# EAGLE design attitude_driver (EAGLE 8.1.1)
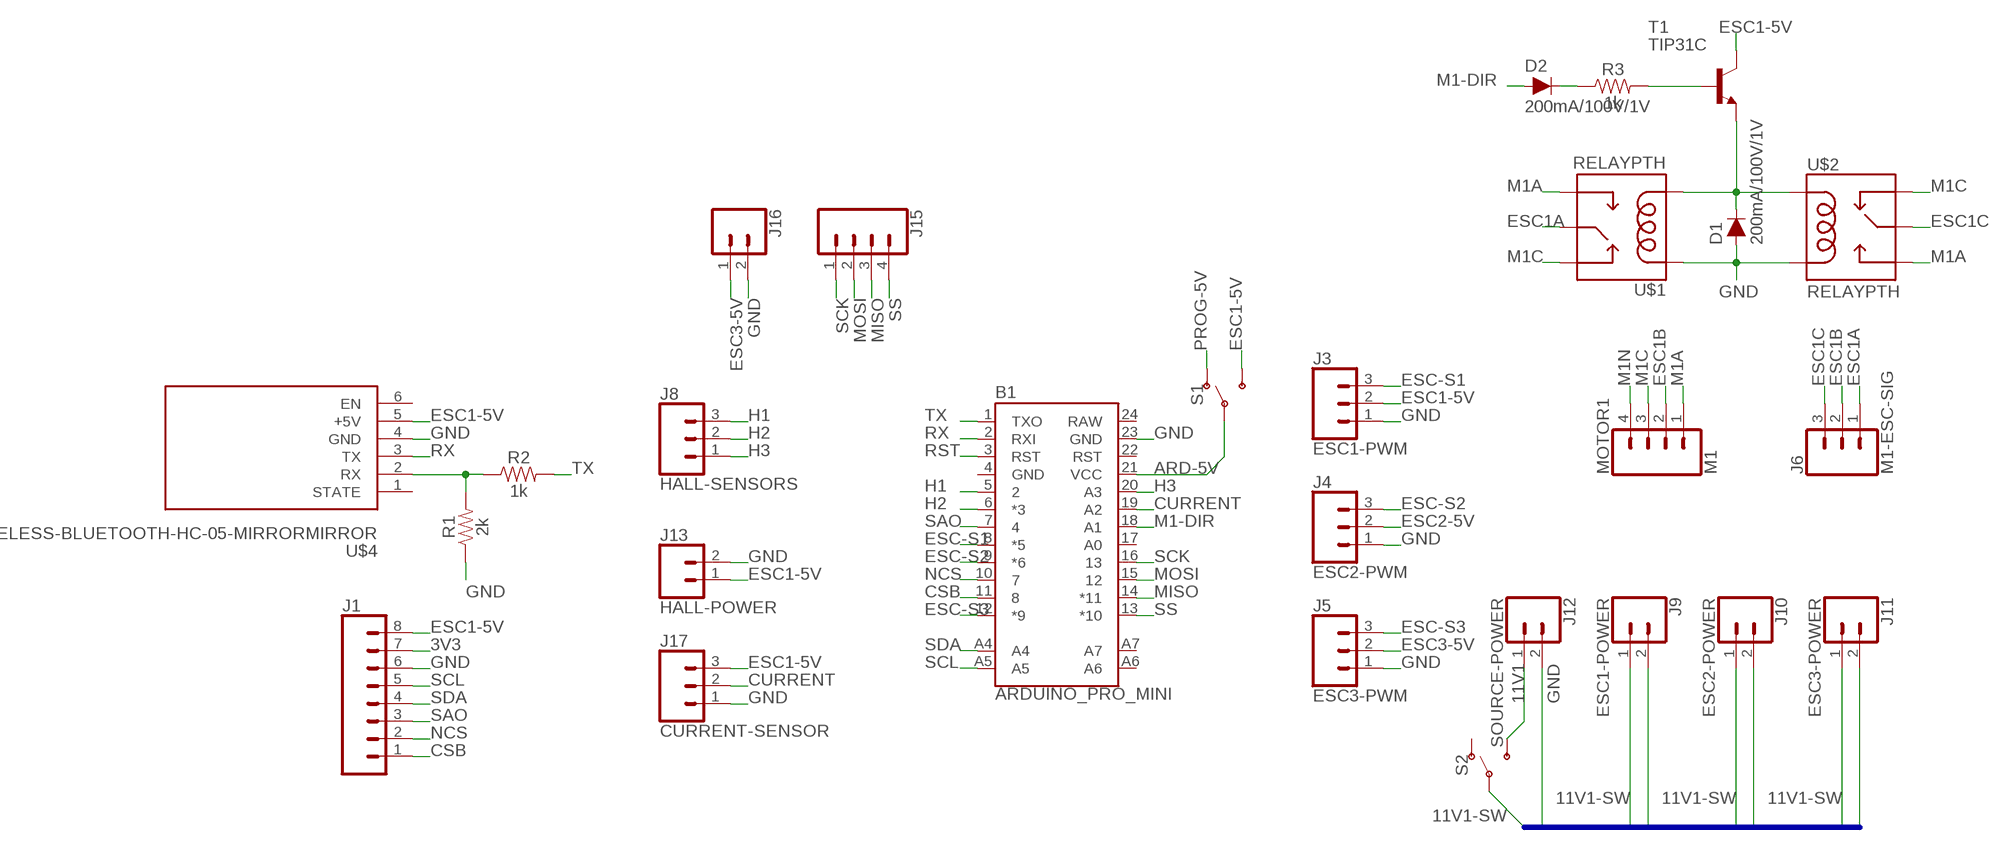
[diagram p0: schematic, sheet 1]

## Parts
B1  ARDUINO_PRO_MINI  [ARDUINO_PRO_MINI]
D1  200mA/100V/1V  DIODE-1N4148  [DIODE-1N4148]
D2  200mA/100V/1V  DIODE-1N4148  [DIODE-1N4148]
J1  GY-91LOCK_LONGPADS  [GY91_LONGPADS]
J3  ESC1-PWM  CONN_03LOCK_LONGPADS  [1X03_LOCK_LONGPADS]
J4  ESC2-PWM  CONN_03LOCK_LONGPADS  [1X03_LOCK_LONGPADS]
J5  ESC3-PWM  CONN_03LOCK_LONGPADS  [1X03_LOCK_LONGPADS]
J6  M1-ESC-SIG  CONN_03LOCK_LONGPADS  [1X03_LOCK_LONGPADS]
J8  HALL-SENSORS  CONN_03LOCK_LONGPADS  [1X03_LOCK_LONGPADS]
J9  ESC1-POWER  CONN_02LOCK_LONGPADS  [1X02_LOCK_LONGPADS]
J10  ESC2-POWER  CONN_02LOCK_LONGPADS  [1X02_LOCK_LONGPADS]
J11  ESC3-POWER  CONN_02LOCK_LONGPADS  [1X02_LOCK_LONGPADS]
J12  SOURCE-POWER  CONN_02LOCK_LONGPADS  [1X02_LOCK_LONGPADS]
J13  HALL-POWER  CONN_02LOCK_LONGPADS  [1X02_LOCK_LONGPADS]
J15  CONN_04LOCK_LONGPADS  [1X04_LOCK_LONGPADS]
J16  CONN_02LOCK_LONGPADS  [1X02_LOCK_LONGPADS]
J17  CURRENT-SENSOR  CONN_03LOCK_LONGPADS  [1X03_LOCK_LONGPADS]
MOTOR1  M1  CONN_04LOCK_LONGPADS  [1X04_LOCK_LONGPADS]
R1  2k  RESISTORAXIAL-0.3  [AXIAL-0.3]
R2  1k  1KOHM-HORIZ-1/4W-5%  [AXIAL-0.3]
R3  1k  1KOHM-HORIZ-1/4W-1%  [AXIAL-0.3]
S1  SWITCH-SPDT-PTH-11.6X4.0MM-LOCK  [SWITCH_SPDT_PTH_11.6X4.0MM_LOCK]
S2  SWITCH-SPDT-PTH-11.6X4.0MM-LOCK  [SWITCH_SPDT_PTH_11.6X4.0MM_LOCK]
T1  TIP31C  [TO220]
U$1  RELAYPTH  [SRD-05VDC-SL-C]
U$2  RELAYPTH  [SRD-05VDC-SL-C]
U$4  WIRELESS-BLUETOOTH-HC-05-MIRRORMIRROR  [WIRELESS-BLUETOOTH-HC-05-MIRROR]

## Nets
3V3: J1.7
11V1: J12.1 S2.3(S)
11V1-SW: J9.1 J10.1 J11.1 S2.2(P)
ARD-5V: B1.21(VCC) S1.2(P)
CSB: B1.11 J1.1
CURRENT: B1.19(A2) J17.2
ESC1-5V: J1.8 J3.2 J13.1 J17.3 S1.3(S) T1.2(C) U$4.5(+5V)
ESC1A: J6.1 U$1.SWCOMMON
ESC1B: J6.2 MOTOR1.2
ESC1C: J6.3 U$2.SWCOMMON
ESC2-5V: J4.2
ESC3-5V: J5.2 J16.1
ESC-S1: B1.8(*5) J3.3
ESC-S2: B1.9(*6) J4.3
ESC-S3: B1.12(*9) J5.3
GND: B1.23(GND) D1.A J1.6 J3.1 J4.1 J5.1 J9.2 J10.2 J11.2 J12.2 J13.2 J16.2 J17.1 R1.P$1 U$1.COIL1 U$2.COIL0 U$4.4(GND)
H1: B1.5 J8.3
H2: B1.6(*3) J8.2
H3: B1.20(A3) J8.1
M1-DIR: B1.18(A1) D2.A
M1A: MOTOR1.1 U$1.SWOPEN U$2.SWOPEN
M1C: MOTOR1.3 U$1.SWCLOSED(SWCLOSE) U$2.SWCLOSED(SWCLOSE)
M1N: MOTOR1.4
MISO: B1.14(*11) J15.3
MOSI: B1.15 J15.2
N$1: R1.P$2 R2.P$1 U$4.2(RX)
N$2: R3.P$2 T1.1(B)
N$3: D2.C R3.P$1
N$4: D1.C T1.3(E) U$1.COIL0 U$2.COIL1
NCS: B1.10 J1.2
PROG-5V: S1.1(O)
RST: B1.3(RST)
RX: B1.2(RXI) U$4.3(TX)
SAO: B1.7 J1.3
SCK: B1.16 J15.1
SCL: B1.A5 J1.5
SDA: B1.A4 J1.4
SS: B1.13(*10) J15.4
TX: B1.1(TXO) R2.P$2
Unconnected: B1.17(A0) B1.22(RST) B1.A6 B1.A7 S2.1(O) U$4.1(STATE) U$4.6(EN)

## Buses
GND,11V1-SW

## Power pins joined to a net without a drawn wire
GND: B1.4(GND)
RAW: B1.24(RAW)

## Library data of the parts
B1 = SparkFun-Boards:ARDUINO_PRO_MINI: SparkFun Pro Mini Pro Mini compatible footprint. Dimensions: 0.7 x 1.3" PCB Thickness: 0.8mm SparkFun Products: 3.3V/8MHz <https://www.sparkfun.com/products/11114> 5V/16MHz <https://www.sparkfun.com/products/11113>
D1 D2 = SparkFun-DiscreteSemi:DIODE: Diode These are standard reverse protection diodes and small signal diodes. SparkFun Products: SparkFun SparkPunk Sound Kit <https://www.sparkfun.com/products/11177> SparkFun ESP8266 Thing <https://www.sparkfun.com/products/13231>; PROD_ID: DIO-08378
J1 = gy-91:GY-91: Multi connection point. Often used as Generic Header-pin footprint for 0.1 inch spaced/style header connections On any of the 0.1 inch spaced packages, you can populate with these: Break Away Headers - Straight <https://www.sparkfun.com/products/116> (PRT-00116) Break Away Male Headers - Right Angle <https://www.sparkfun.com/products/553> (PRT-00553) Female Headers <https://www.sparkfun.com/products/115> (PRT-00115) Break Away Headers - Machine Pin <https://www.sparkfun.com/products/117> (PRT-00117) Break Away Female Headers - Swiss Machine Pin <https://www.sparkfun.com/products/743> (PRT-00743) Arduino Stackable Header - 8 Pin <https://www.sparkfun.com/products/9279> (PRT-09279) For SCREWTERMINALS and SPRING TERMINALS visit here: Screw Terimnals on SparkFun.com <https://www.sparkfun.com/search/results?term=Screw+Terminals> (5mm/3.5mm/2.54mm spacing) This device is also useful as a general connection point to wire up your design to another part of your project. Our various solder wires solder well into these plated through hole pads. Hook-Up Wire - Assortment (Stranded, 22 AWG) <https://www.sparkfun.com/products/11375> (PRT-11375) Hook-Up Wire - Assortment (Solid Core, 22 AWG) <https://www.sparkfun.com/products/11367> (PRT-11367) View the entire wire category on our website here <https://www.sparkfun.com/categories/141> Special notes: Molex polarized connector foot print use with SKU : PRT-08231 with associated crimp pins and housings. 1MM SMD Version SKU: PRT-10208 NOTES ON THE VARIANTS LOCK and LOCK_LONGPADS... This footprint was designed to help hold the alignment of a through-hole component (i.e. 6-pin header) while soldering it into place. You may notice that each hole has been shifted either up or down by 0.005 of an inch from it's more standard position (which is a perfectly straight line). This slight alteration caused the pins (the squares in the middle) to touch the edges of the holes. Because they are alternating, it causes a "brace" to hold the component in place. 0.005 has proven to be the perfect amount of "off-center" position when using our standard breakaway headers. Although looks a little odd when you look at the bare footprint, once you have a header in there, the alteration is very hard to notice. Also,if you push a header all the way into place, it is covered up entirely on the bottom side.
J3-J6 J8 J17 = SparkFun-Connectors:CONN_03: Multi connection point. Often used as Generic Header-pin footprint for 0.1 inch spaced/style header connections On any of the 0.1 inch spaced packages, you can populate with these: Break Away Headers - Straight <https://www.sparkfun.com/products/116> (PRT-00116) Break Away Male Headers - Right Angle <https://www.sparkfun.com/products/553> (PRT-00553) Female Headers <https://www.sparkfun.com/products/115> (PRT-00115) Break Away Headers - Machine Pin <https://www.sparkfun.com/products/117> (PRT-00117) Break Away Female Headers - Swiss Machine Pin <https://www.sparkfun.com/products/743> (PRT-00743) Stackable Header - 3 Pin (Female, 0.1") <https://www.sparkfun.com/products/13875> (PRT-13875) For SCREWTERMINALS and SPRING TERMINALS visit here: Screw Terimnals on SparkFun.com <https://www.sparkfun.com/search/results?term=Screw+Terminals> (5mm/3.5mm/2.54mm spacing) This device is also useful as a general connection point to wire up your design to another part of your project. Our various solder wires solder well into these plated through hole pads. Hook-Up Wire - Assortment (Stranded, 22 AWG) <https://www.sparkfun.com/products/11375> (PRT-11375) Hook-Up Wire - Assortment (Solid Core, 22 AWG) <https://www.sparkfun.com/products/11367> (PRT-11367) View the entire wire category on our website here <https://www.sparkfun.com/categories/141> Special notes: Molex polarized connector foot print use with SKU : PRT-08232 with associated crimp pins and housings.
J9-J13 J16 = SparkFun-Connectors:CONN_02: Multi connection point. Often used as Generic Header-pin footprint for 0.1 inch spaced/style header connections On any of the 0.1 inch spaced packages, you can populate with these: Break Away Headers - Straight <https://www.sparkfun.com/products/116> (PRT-00116) Break Away Male Headers - Right Angle <https://www.sparkfun.com/products/553> (PRT-00553) Female Headers <https://www.sparkfun.com/products/115> (PRT-00115) Break Away Headers - Machine Pin <https://www.sparkfun.com/products/117> (PRT-00117) Break Away Female Headers - Swiss Machine Pin <https://www.sparkfun.com/products/743> (PRT-00743) For SCREWTERMINALS and SPRING TERMINALS visit here: Screw Terimnals on SparkFun.com <https://www.sparkfun.com/search/results?term=Screw+Terminals> (5mm/3.5mm/2.54mm spacing) This device is also useful as a general connection point to wire up your design to another part of your project. Our various solder wires solder well into these plated through hole pads. Hook-Up Wire - Assortment (Stranded, 22 AWG) <https://www.sparkfun.com/products/11375> (PRT-11375) Hook-Up Wire - Assortment (Solid Core, 22 AWG) <https://www.sparkfun.com/products/11367> (PRT-11367) View the entire wire category on our website here <https://www.sparkfun.com/categories/141> Special notes: Molex polarized connector foot print use with: PRT-08233 with associated crimp pins and housings. 2.54_SCREWTERM for use with PRT-10571. 3.5mm Screw Terminal footprints for PRT-08084 5mm Screw Terminal footprints for use with PRT-08432
J15 MOTOR1 = SparkFun-Connectors:CONN_04: Multi connection point. Often used as Generic Header-pin footprint for 0.1 inch spaced/style header connections On any of the 0.1 inch spaced packages, you can populate with these: Break Away Headers - Straight <https://www.sparkfun.com/products/116> (PRT-00116) Break Away Male Headers - Right Angle <https://www.sparkfun.com/products/553> (PRT-00553) Female Headers <https://www.sparkfun.com/products/115> (PRT-00115) Break Away Headers - Machine Pin <https://www.sparkfun.com/products/117> (PRT-00117) Break Away Female Headers - Swiss Machine Pin <https://www.sparkfun.com/products/743> (PRT-00743) For SCREWTERMINALS and SPRING TERMINALS visit here: Screw Terimnals on SparkFun.com <https://www.sparkfun.com/search/results?term=Screw+Terminals> (5mm/3.5mm/2.54mm spacing) This device is also useful as a general connection point to wire up your design to another part of your project. Our various solder wires solder well into these plated through hole pads. Hook-Up Wire - Assortment (Stranded, 22 AWG) <https://www.sparkfun.com/products/11375> (PRT-11375) Hook-Up Wire - Assortment (Solid Core, 22 AWG) <https://www.sparkfun.com/products/11367> (PRT-11367) View the entire wire category on our website here <https://www.sparkfun.com/categories/141> Special notes: Molex polarized connector foot print use with SKU : PRT-08231 with associated crimp pins and housings. 1MM SMD Version SKU: PRT-10208; PROD_ID: CONN-09696
R1 = resistors-longpads:RESISTOR: Generic Resistor Package
R2 = resistors-longpads:1KOHM: 1kΩ resistor A resistor is a passive two-terminal electrical component that implements electrical resistance as a circuit element. Resistors act to reduce current flow, and, at the same time, act to lower voltage levels within circuits. - Wikipedia; PROD_ID: RES-08380
R3 = SparkFun-Resistors:1KOHM: 1kΩ resistor A resistor is a passive two-terminal electrical component that implements electrical resistance as a circuit element. Resistors act to reduce current flow, and, at the same time, act to lower voltage levels within circuits. - Wikipedia; PROD_ID: RES-12182
S1 S2 = switch-longpads:SWITCH-SPDT: Single Pole, Double Throw (SPDT) Switch Single-pole, double-throw (SPDT) switch. Variant Overview SMD-AYZ0202 Surface Mount DPDT Switch <https://www.sparkfun.com/products/597> (COM-00597) Used on e.g. LilyPad Arduino USB - ATmega32U4 Board <https://www.sparkfun.com/products/12049> PTH-11.6X4.0MM SPDT Mini Power Switch <https://www.sparkfun.com/products/102> (COM-00102) Used on e.g. SparkFun Simon Says - Through-Hole Soldering Kit <https://www.sparkfun.com/products/10547> (KIT-10547) PTH-11.6X4.0MM-KIT KIT version of SPDT Mini Power Switch - Simplifies soldering by removing tStop of switch pins - only one side can be soldered. PTH-11.6X4.0MM-LOCK LOCK version of SPDT Mini Power Switch - Offset pins hold switch in place for easier soldering. SMD-RIGHT-ANGLE Surface Mount Right Angle Switch <https://www.sparkfun.com/products/10860> (COM-10860) Used on e.g. SparkFun ESP8266 Thing <https://www.sparkfun.com/products/13231>; PROD_ID: SWCH-08261; SF_SKU: COM-00102
T1 = transistor-neu-to92:TIP31C: NPN TRANSISTOR
U$1 U$2 = SRD-05VDC-SL-C:RELAY: SPDT relay (COM-00101)
U$4 = diy-modules:WIRELESS-BLUETOOTH-HC-05-MIRROR: Bluetooth Transceiver Module based on HC-05 board Tutorial is available here: https://arduino-info.wikispaces.com/BlueTooth-HC05-HC06-Modules-How-To Click here to find device on ebay.com <http://www.ebay.com/sch/hc-05+module+rs232>

## Net classes
0 default: width 1 mm, clearance 0.3 mm

## Board
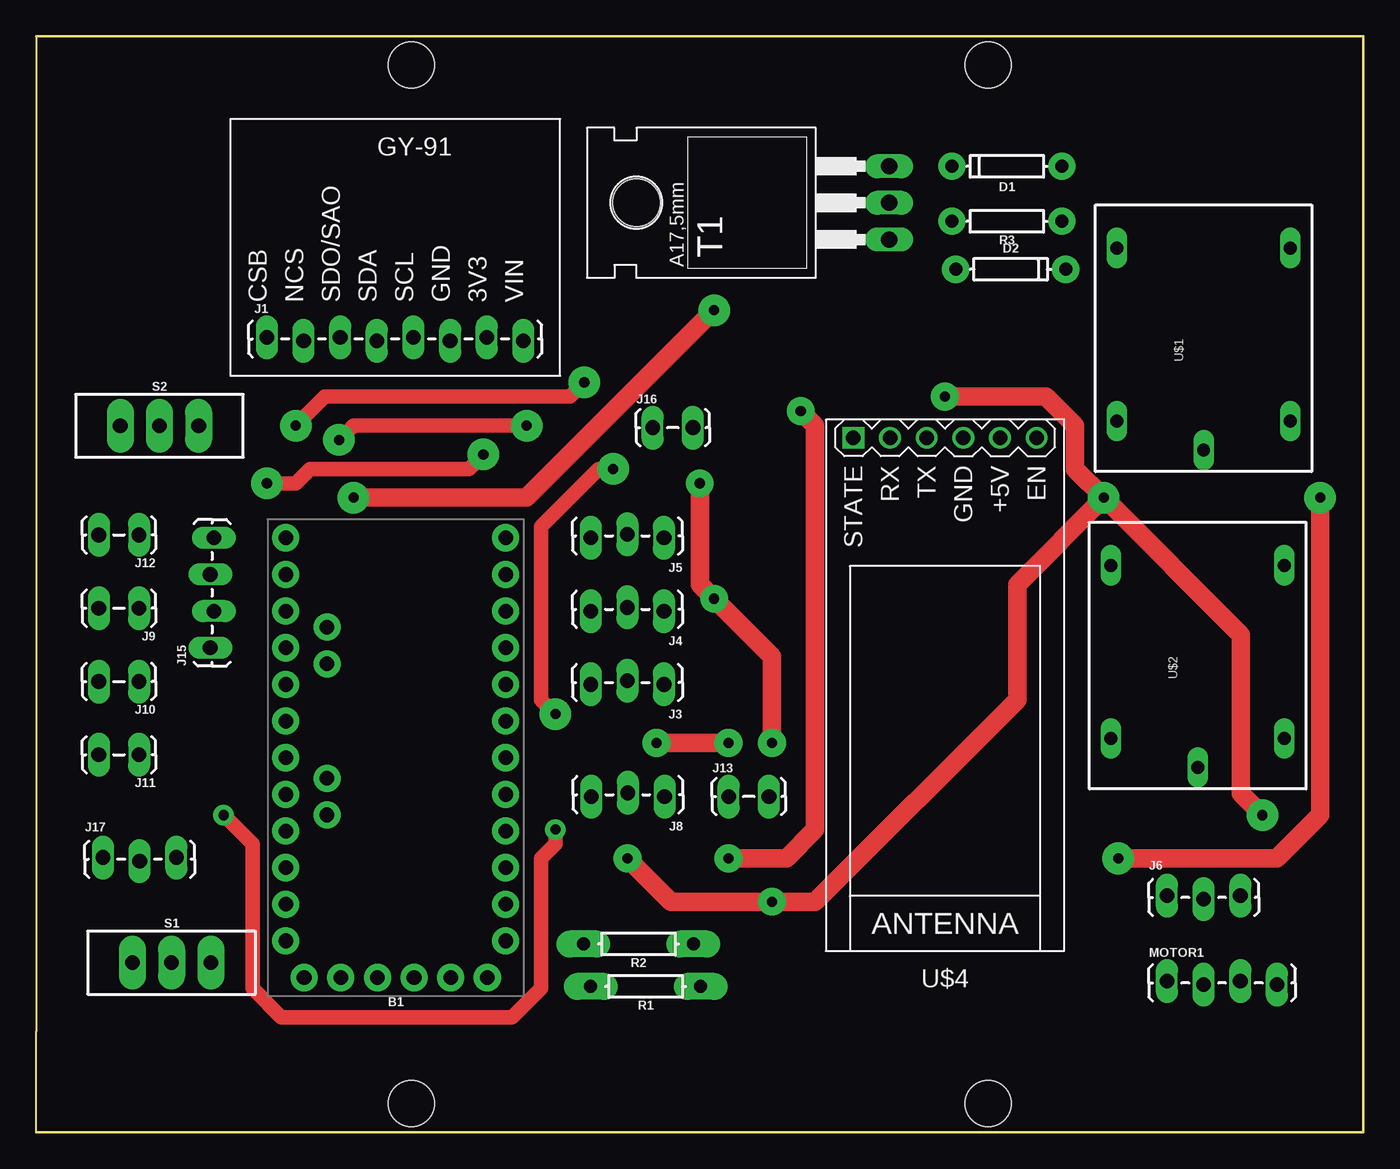
[diagram p1: board, top side]
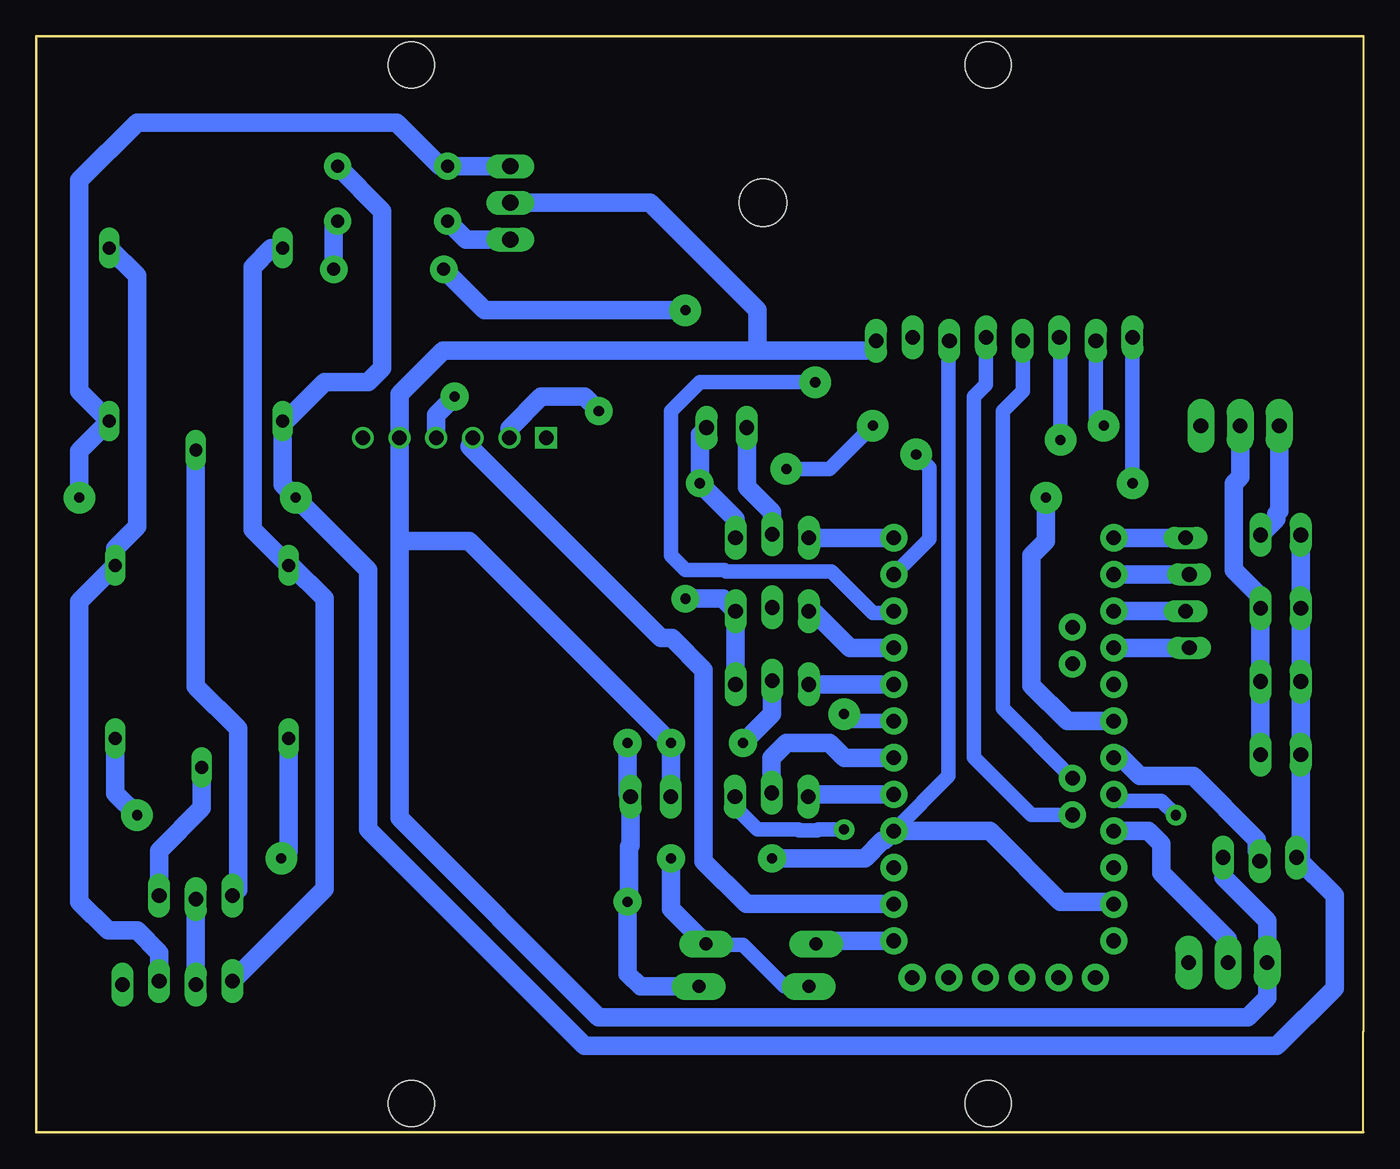
[diagram p2: board, bottom side, seen from below]

Size 92 x 76 mm. Coordinates in mm from the lower left corner, seen from the top.
Outline: 0,76 0,7 0,0 92,0 92,76 0,76
Copper layers (1*16): Top 0.035mm / dielectric 1.5mm / Bottom 0.035mm
Design rules "attitude_driver *": minimum track width 1mm, minimum drill 0.7mm, track to track 0.205mm, track to pad 0.205mm, pad to pad 0.205mm, via to via 0.205mm, smd to smd 6mil, copper to edge 1mm, drill to drill 6mil, minimum pad ring 10mil, minimum via ring 8mil, stop-mask expansion 4mil, vias tented up to drill 0mil, thermal gap 10mil
Holes 3.2 mm at 66,2 26,2 66,74 26,74

### Footprints (pad centres in the part's own frame; a part is rotated, then mirrored left to right if it is on the bottom)
ARDUINO_PRO_MINI = drill 1.016 pad 1.88: 1 -7.62,12.7; 2 -7.62,10.16; 3 -7.62,7.62; 4 -7.62,5.08; 5 -7.62,2.54; 6 -7.62,0; 7 -7.62,-2.54; 8 -7.62,-5.08; 9 -7.62,-7.62; 10 -7.62,-10.16; 11 -7.62,-12.7; 12 -7.62,-15.24; 13 7.62,-15.24; 14 7.62,-12.7; 15 7.62,-10.16; 16 7.62,-7.62; 17 7.62,-5.08; 18 7.62,-2.54; 19 7.62,0; 20 7.62,2.54; 21 7.62,5.08; 22 7.62,7.62; 23 7.62,10.16; 24 7.62,12.7; A4 4.763,1.429; A5 4.763,3.969; A6 4.763,-9.049; A7 4.763,-6.509; BLK -6.35,15.24; GND -3.81,15.24; GRN 6.35,15.24; RXI 1.27,15.24; TXO 3.81,15.24; VCC -1.27,15.24
DIODE-1N4148 = drill 0.9 pad 1.88: A -3.81,0; C 3.81,0
GY91_LONGPADS = drill 1.016 long: 1 0,0.127; 2 2.54,-0.127; 3 5.08,0.127; 4 7.62,-0.127; 5 10.16,0.127; 6 12.7,-0.127; 7 15.24,0.127; 8 17.78,-0.127
1X03_LOCK_LONGPADS = drill 1.016 long: 1 0,0; 2 2.54,-0.254; 3 5.08,0
1X02_LOCK_LONGPADS = drill 1.016 long: 1 -0.127,0; 2 2.667,0
1X04_LOCK_LONGPADS = drill 1.016 long: 1 0,0; 2 2.54,-0.254; 3 5.08,0; 4 7.62,-0.254
AXIAL-0.3 = drill 0.9 pad 1.88 long: P$1 -3.81,0; P$2 3.81,0
AXIAL-0.3' = drill 0.9 pad 1.88: P$1 -3.81,0; P$2 3.81,0
SWITCH_SPDT_PTH_11.6X4.0MM_LOCK = drill 1.016 pad 1.88 long: 1 0,2.718; 2 0,0; 3 0,-2.718
TO220 = drill 1.118 long: 1 -2.54,-6.35; 2 0,-6.35; 3 2.54,-6.35 | hole 3.302: 0,11.176
SRD-05VDC-SL-C = drill 0.9 long: COIL0 -5.39,-6.12; COIL1 -5.39,5.88; SWCLOSED 6.61,-6.12; SWCOMMON -7.39,-0.12; SWOPEN 6.61,5.88
WIRELESS-BLUETOOTH-HC-05-MIRROR = drill 1 square: 1 6.35,-17.145 | drill 1: 2 3.81,-17.145; 3 1.27,-17.145; 4 -1.27,-17.145; 5 -3.81,-17.145; 6 -6.35,-17.145

### Placement (x,y rotation side)
B1  24.93,25.98 180 top
D1  67.29,66.98 180 top
D2  67.55,59.83 0 top
J1  16,55 0 top
J3  43.52,31.06 180 top
J4  43.52,36.14 180 top
J5  43.52,41.22 180 top
J6  78.39,16.42 0 top
J8  43.56,23.29 180 top
J9  7.01,36.34 180 top
J10  7.01,31.26 180 top
J11  7.01,26.18 180 top
J12  7.01,41.42 180 top
J13  48.13,23.29 0 top
J15  12.07,33.6 90 top
J16  42.86,48.86 0 top
J17  4.64,19.07 0 top
MOTOR1  78.39,10.5 0 top
R1  42.25,10.12 180 top
R2  41.75,13.07 180 top
R3  1k  [AXIAL-0.3']  67.29,63.17 180 top
S1  9.39,11.77 270 top
S2  8.55,48.98 270 top
T1  52.78,64.44 90 top
U$1  80.8,54.7 90 top
U$2  80.39,32.7 90 top
U$4  63,31 180 top

### Tracks (layer width: path | path; a pad name or v marks a point on that pad's centre or on a via)
11V1
  Bottom 1.27: J12.1 6.04,42.52 6.04,42.88 5.83,43.09 S2.3
11V1-SW
  Bottom 1.27: J11.1 J10.1 J9.1 7.14,37.14 9,39 9,45 8.55,45.45 S2.2
ARD-5V
  Bottom 1.27: S1.2 9.39,13.39 14,18 14,20 14.9,20.9 B1.21
CSB  (via drill 0.7 pad 2.18)
  Top 1.016: v16,45 18,45 19,46 30,46 v31,47
  Bottom 1.016: B1.11 30.08,41.15 30.08,46.08 v31,47 | v16,45 J1.1
CURRENT
  Bottom 1.27: J17.2 7.38,19.54 7.38,20.27 11.8,24.7 15.49,24.7 16.96,26.18 B1.19
ESC1-5V  (via drill 0.7 pad 1.93)
  Top 1.27: v43,27 v48,27
  Bottom 1.27: 42,54.2 33.92,54.2 J1.8 | T1.2 49.44,64.44 42,57 42,54.2 | J17.3 9.72,17.72 6.67,14.67 S1.3 6.67,9.33 8,8 53,8 66.81,21.81 66.81,41 | J3.2 40.98,29.02 v43,27 | J13.1 v48,27 62,41 66.81,41 | 66.81,45.81 U$4.5 | 66.81,41 U$4.5 | U$4.5 66.81,51.19 63.8,54.2 42,54.2
ESC1A
  Bottom 1.27: U$1.SWCOMMON 80.92,30.92 78,28 78,16.81 J6.1
ESC1B
  Bottom 1.27: MOTOR1.2 J6.2
ESC1C
  Bottom 1.27: J6.3 83.47,19.53 80.51,22.49 U$2.SWCOMMON
ESC3-5V
  Bottom 1.27: J5.2 41,41.47 41,43 42.73,44.73 J16.1
ESC-S1
  Bottom 1.27: J3.3 B1.8
ESC-S2
  Bottom 1.27: J4.3 38.14,36.14 35.6,33.6 B1.9
ESC-S3
  Bottom 1.27: J5.3 B1.12
GND  (via drill 0.7 pad 1.93, 0.7 pad 2.18)
  Top 1.27: v74,44 83.5,34.5 83.5,23.5 v85,22 | v46,45 46,38 v47,37 51,33 v51,27 | v41,19 44,16 v51,16 54,16 68,30 68,38 v74,44 | v63,51 70,51 72,49 72,46 v74,44
  Bottom 1.016: 32.45,21.01 28.76,24.7 28.76,54.2
  Bottom 1.27: 32.45,21.01 B1.4 | 28.76,54.2 J1.6 | J12.2 J9.2 J10.2 J11.2 4.34,19.07 J17.1 2,16.43 2,10 6,6 54,6 69,21 69,39 v74,44 74.92,44.92 U$1.COIL1 74.69,49.31 72,52 69,52 68,53 68,63.88 D1.A | B1.23 17.49,16 21,16 25.9,20.9 B1.4 | v85,22 86.51,23.51 U$2.COIL0 | J3.1 J4.1 44.38,37 v47,37 | J5.1 43.52,42.52 v46,45 46,48.39 J16.2 | B1.4 33.22,20.23 33.33,20.23 34.56,19 v41,19 | R1.P$1 50.12,10.12 51,11 v51,16 50.9,16.1 50.9,19.79 50.8,19.89 J13.2 51,23.49 v51,27 | U$4.4 64.27,49.73 v63,51
H1
  Bottom 1.27: J8.3 38.33,23.44 B1.5
H2
  Bottom 1.27: B1.6 35.98,25.98 37,27 40,27 41.02,25.98 J8.2
H3  (via drill 0.7 pad 1.42)
  Top 1.016: v13,22 15,20 15,10 17,8 33,8 35,10 35,19 36,20 v36,21
  Bottom 1.016: B1.20 16.87,23 14,23 v13,22 | v36,21 37.79,21 37.83,20.96 39.13,20.96 39.17,21 42,21 43.56,22.56 J8.1
M1-DIR  (via drill 0.7 pad 2.18)
  Top 1.27: v22,44 34,44 v47,57
  Bottom 1.27: B1.18 20.52,28.52 23,31 23,40 22,41 v22,44 | v47,57 60.91,57 D2.A
M1A
  Bottom 1.27: MOTOR1.1 72,16.89 72,37 74.31,39.31 U$2.SWOPEN 77,41.8 77,60 75.69,61.31 U$1.SWOPEN
M1C
  Bottom 1.27: U$1.SWCLOSED 85,59.39 85,42 86.51,40.49 U$2.SWCLOSED 89,36.82 89,16 87,14 85,14 83.47,12.47 MOTOR1.3
MISO
  Bottom 1.27: J15.3 B1.14
MOSI
  Bottom 1.27: J15.2 B1.15
N$1  (via drill 0.7 pad 1.93)
  Top 1.27: v48,19 52,19 54,21 54,49 v53,50
  Bottom 1.016: R1.P$2 40.12,10.12 43,13 45.49,13 R2.P$1
  Bottom 1.27: v53,50 54,51 57,51 59.19,48.81 U$4.2 | v48,19 48,15.51 R2.P$1
N$2
  Bottom 1.27: T1.1 62.21,61.9 R3.P$2
N$3
  Bottom 1.27: D2.C 71.36,62.91 R3.P$1
N$4  (via drill 0.7 pad 2.18)
  Top 1.27: v89,44 89,22 86,19 v75,19
  Bottom 1.27: T1.3 D1.C 63.98,66.98 67,70 85,70 89,66 89,51.39 U$1.COIL0 89,47.23 v89,44 | v75,19 74.51,19.49 U$2.COIL1
NCS  (via drill 0.7 pad 2.18)
  Top 1.016: v38,52 37,51 20,51 v18,49
  Bottom 1.016: B1.10 32.69,36 34,36 36.89,38.89 44.17,38.89 44.28,39 47,39 48,40 48,50 46,52 v38,52 | v18,49 18.54,49.54 J1.2
RX
  Bottom 1.27: U$4.3 61.95,47.56 48.67,34.29 47.94,34.29 45.73,32.08 45.73,18.8 42.77,15.85 33.19,15.85 B1.2
SAO  (via drill 0.7 pad 2.18)
  Top 1.016: v40,46 39,46 35,42 35,30 v36,29 | v21,48 22,49 v34,49
  Bottom 1.016: J1.3 21,55.05 v21,48 | v36,29 35.52,28.52 B1.7 | v34,49 37,46 v40,46
SCK
  Bottom 1.27: J15.1 B1.16
SCL
  Bottom 1.016: B1.A5 23,22 27,26 27,51 26.16,51.84 J1.5
SDA
  Bottom 1.016: B1.A4 25,29.38 25,50 23.62,51.38 J1.4
SS
  Bottom 1.27: J15.4 B1.13
TX
  Bottom 1.27: R2.P$2 37.73,13.28 B1.1